# Altium schematic sheet nguon5v.SchDoc
size A
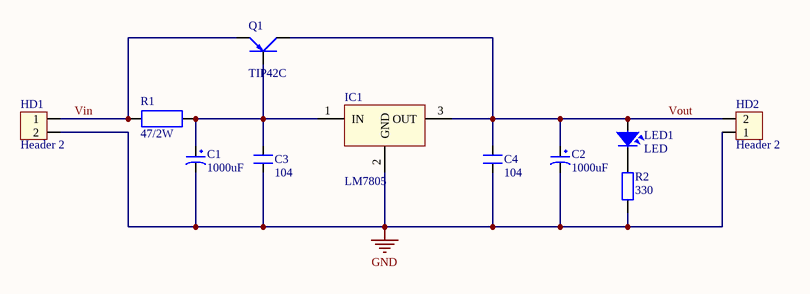
[diagram p0: nguon5v.SchDoc]

## Parts
C1  1000uF  [CP1/2]
C2  1000uF  [CP1/2]
C3  104  [CN1.5]
C4  104  [CN1.5]
HD1  Header 2  [HED2]
HD2  Header 2  [HED2]
IC1  LM7805  [QTO-220]
LED1  LED  [LED-3]
Q1  TIP42C  [QTO-220]
R1  47/2W  [R2W]
R2  330  [R1/4W]

## Nets
GND: C1.2 C2.2 C3.1 C4.1 HD1.2 HD2.1 IC1.2(GND) R2.1
Vin: HD1.1 Q1.3(E) R1.1
Vout: C2.1 C4.2 HD2.2 IC1.3(OUT) LED1.1 Q1.2(C)
NetC1_1: C1.1 C3.2 IC1.1(IN) Q1.1(B) R1.2
NetLED1_2: LED1.2 R2.2

## Library data of the parts
C1 C2 = CP1: Cap P  0,1uF < 22uF , 16 - 50V; Value: 10uF/50V; Description 1: 10 => 220uF/6,3V/10V - 10uF => 100uF/16V; Description 2: 0,1uF => 33uF/50V - 10uF => 22uF/63V; Description 3: 0,47uF => 10uF/100V
C3 C4 = CN1.5: Cap np 682pF => 104pF; Value: 0.01uF
HD1 HD2 = Hed2: Header 2 (Green); Value: Header 2
IC1 = LM78xx: On ap +, from + 5 to + 24VDC; Value: LM7805
LED1 = LED: LED Single colour Green and Red; Value: LED 3 ly Single Colour
Q1 = TIP42C: PNP 2W, BCE; Value: TIP42C
R1 = R2W: Resistor 2W; Value: R2W - 47
R2 = R1/4W: Resistor 1/4W; Value: R1/4W - 1K